# EAGLE design hwc (EAGLE 7.4.0)
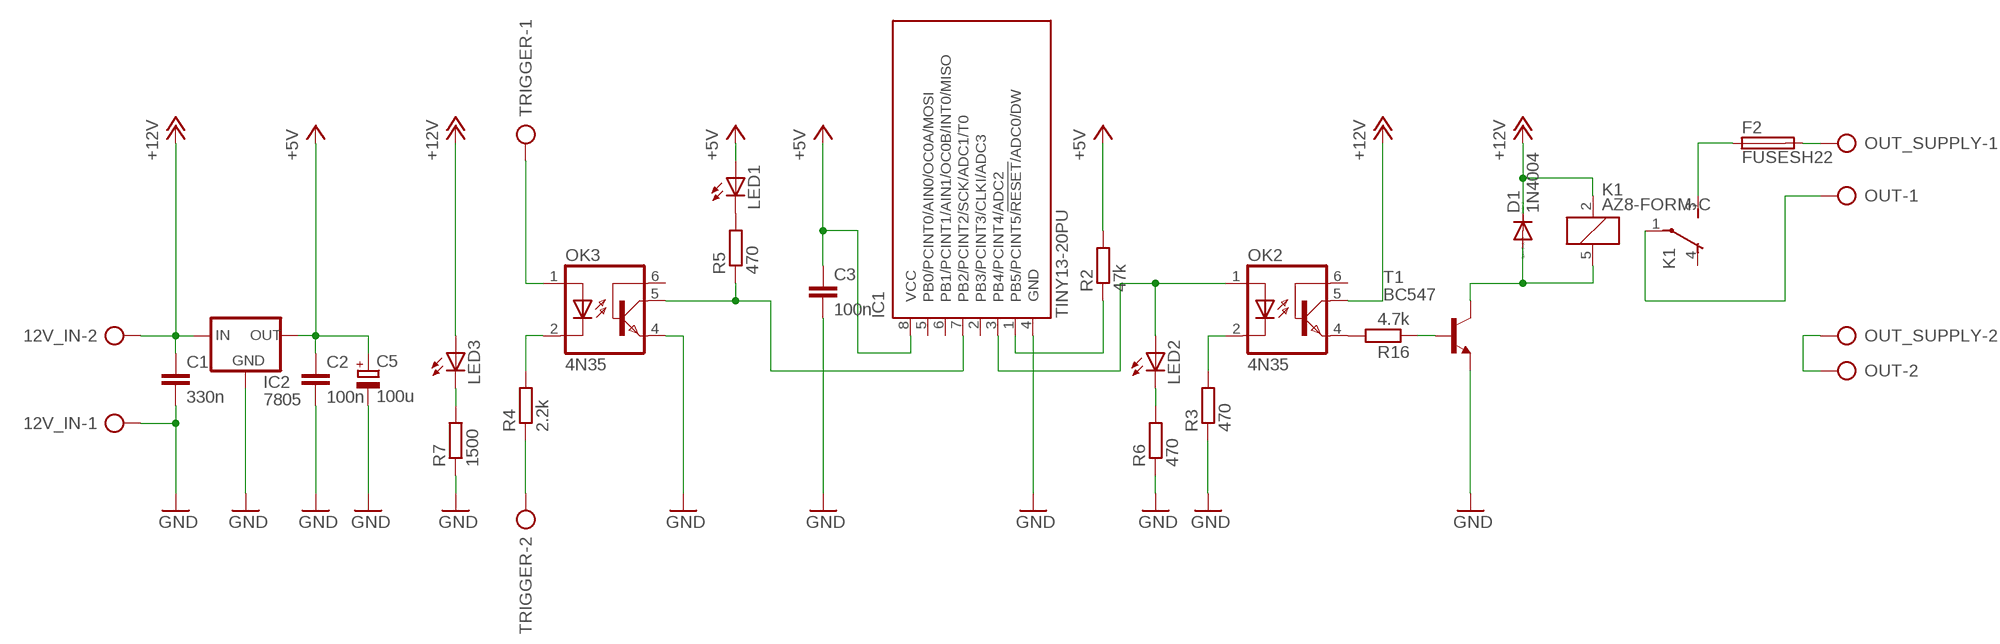
[diagram p0: schematic, sheet 1]

## Parts
12V_IN  AK300/2  [AK300/2]
C1  330n  C-EU050-025X075  [C050-025X075]
C2  100n  C-EU050-025X075  [C050-025X075]
C3  100n  C-EU050-025X075  [C050-025X075]
C5  100u  CPOL-EUE5-8.5  [E5-8,5]
D1  1N4004  [DO41-10]
F2  FUSESH22  [SH22]
IC1  TINY13-20PU  [DIL08]
IC2  7805  78XXL  [78XXL]
K1  AZ8-FORM-C  [AZ8]
LED1  LED5MM  [LED5MM]
LED2  LED5MM  [LED5MM]
LED3  LED5MM  [LED5MM]
OK2  4N35  [DIL06]
OK3  4N35  [DIL06]
OUT  AK300/2  [AK300/2]
OUT_SUPPLY  AK300/2  [AK300/2]
R2  47k  R-EU_0204/7  [0204/7]
R3  470  R-EU_0204/7  [0204/7]
R4  2.2k  R-EU_0204/7  [0204/7]
R5  470  R-EU_0204/7  [0204/7]
R6  470  R-EU_0204/7  [0204/7]
R7  1500  R-EU_0204/7  [0204/7]
R16  4.7k  R-EU_0204/7  [0204/7]
T1  BC547  [TO92]
TRIGGER  AK300/2  [AK300/2]

## Nets
+5V: C2.1 C3.1 C5.+ IC1.8(VCC) IC2.OUT LED1.A R2.2
+12V: 12V_IN.2 C1.1 D1.C IC2.IN K1.2 LED3.A OK2.5(COL)
GND: 12V_IN.1 C1.2 C2.2 C3.2 C5.- IC1.4(GND) IC2.GND OK3.4(EMI) R3.1 R6.1 R7.1 T1.1(E)
N$1: IC1.1(PB5/PCINT5/!RESET!/ADC0/DW) R2.1
N$2: LED1.K(C) R5.2
N$3: OUT.2 OUT_SUPPLY.2
N$4: F2.1 K1.3(-1:S)
N$5: K1.1(-1:P) OUT.1
N$6: LED2.K(C) R6.2
N$7: LED3.K(C) R7.2
N$8: OK2.2(C) R3.2
N$9: IC1.3(PB4/PCINT4/ADC2) LED2.A OK2.1(A)
N$10: F2.2 OUT_SUPPLY.1
N$11: OK3.2(C) R4.2
N$12: OK3.1(A) TRIGGER.1
N$13: R4.1 TRIGGER.2
N$14: IC1.7(PB2/PCINT2/SCK/ADC1/T0) OK3.5(COL) R5.1
N$35: OK2.4(EMI) R16.2
N$36: D1.A K1.5 T1.3(C)
N$37: R16.1 T1.2(B)
Unconnected: IC1.2(PB3/PCINT3/CLKI/ADC3) IC1.5(PB0/PCINT0/AIN0/OC0A/MOSI) IC1.6(PB1/PCINT1/AIN1/OC0B/INT0/MISO) K1.4(-1:O) OK2.6(BAS) OK3.6(BAS)

## Library data of the parts
12V_IN OUT OUT_SUPPLY TRIGGER = con-ptr500:AK300/2: CONNECTOR; OC_FARNELL: unknown; OC_NEWARK: unknown
C1-C3 = rcl:C-EU: CAPACITOR, European symbol
C5 = rcl:CPOL-EU: POLARIZED CAPACITOR, European symbol
D1 = diode:1N4004: DIODE general purpose rectifier, 1 A
F2 = fuse:FUSE: Fuse; OC_FARNELL: unknown; OC_NEWARK: unknown
IC1 = atmel:TINY13: 8-bit AVR Microcontroller with 1K Bytes In-System Programmable Flash Source: http://www.atmel.com/dyn/resources/prod_documents/2535S.pdf; MPN: ATTINY13-20PU; OC_FARNELL: 9171550; OC_NEWARK: 96K6521
IC2 = v-reg:78XXL: VOLTAGE REGULATOR
K1 = relay:AZ8-FORM-C: MINIATURE PC BOARD RELAY Form C Source: www.azettler.com .. AZ8-1ch-12DSE.PDF; OC_FARNELL: unknown; OC_NEWARK: unknown
LED1-LED3 = led:LED: LED OSRAM: - CHIPLED LG R971, LG N971, LY N971, LG Q971, LY Q971, LO R971, LY R971 LH N974, LH R974 LS Q976, LO Q976, LY Q976 LO Q996 - Hyper CHIPLED LW Q18S LB Q993, LB Q99A, LB R99A - SideLED LS A670, LO A670, LY A670, LG A670, LP A670 LB A673, LV A673, LT A673, LW A673 LH A674 LY A675 LS A676, LA A676, LO A676, LY A676, LW A676 LS A679, LY A679, LG A679 - Hyper Micro SIDELED® LS Y876, LA Y876, LO Y876, LY Y876 LT Y87S - SmartLED LW L88C, LW L88S LB L89C, LB L89S, LG L890 LS L89K, LO L89K, LY L89K LS L896, LA L896, LO L896, LY L896 - TOPLED LS T670, LO T670, LY T670, LG T670, LP T670 LSG T670, LSP T670, LSY T670, LOP T670, LYG T670 LG T671, LOG T671, LSG T671 LB T673, LV T673, LT T673, LW T673 LH T674 LS T676, LA T676, LO T676, LY T676, LB T676, LH T676, LSB T676, LW T676 LB T67C, LV T67C, LT T67C, LS T67K, LO T67K, LY T67K, LW E67C LS E67B, LA E67B, LO E67B, LY E67B, LB E67C, LV E67C, LT E67C LW T67C LS T679, LY T679, LG T679 LS T770, LO T770, LY T770, LG T770, LP T770 LB T773, LV T773, LT T773, LW T773 LH T774 LS E675, LA E675, LY E675, LS T675 LS T776, LA T776, LO T776, LY T776, LB T776 LHGB T686 LT T68C, LB T68C - Hyper Mini TOPLED® LB M676 - Mini TOPLED Santana® LG M470 LS M47K, LO M47K, LY M47K Source: http://www.osram.convergy.de LUXEON: - LUMILED® LXK2-PW12-R00, LXK2-PW12-S00, LXK2-PW14-U00, LXK2-PW14-V00 LXK2-PM12-R00, LXK2-PM12-S00, LXK2-PM14-U00 LXK2-PE12-Q00, LXK2-PE12-R00, LXK2-PE12-S00, LXK2-PE14-T00, LXK2-PE14-U00 LXK2-PB12-K00, LXK2-PB12-L00, LXK2-PB12-M00, LXK2-PB14-N00, LXK2-PB14-P00, LXK2-PB14-Q00 LXK2-PR12-L00, LXK2-PR12-M00, LXK2-PR14-Q00, LXK2-PR14-R00 LXK2-PD12-Q00, LXK2-PD12-R00, LXK2-PD12-S00 LXK2-PH12-R00, LXK2-PH12-S00 LXK2-PL12-P00, LXK2-PL12-Q00, LXK2-PL12-R00 Source: www.luxeon.com KINGBRIGHT: KA-3528ASYC Source: www.kingbright.com
OK2 OK3 = optocoupler:4N35: MOTOROLA OPTO COUPLER; MF: FAIRCHILD SEMICONDUCTOR; MPN: 4N35; OC_FARNELL: 1328375; OC_NEWARK: 72K9946
R2-R7 R16 = rcl:R-EU_: RESISTOR, European symbol
T1 = transistor:BC547: NPN TRANSISTOR

## Board
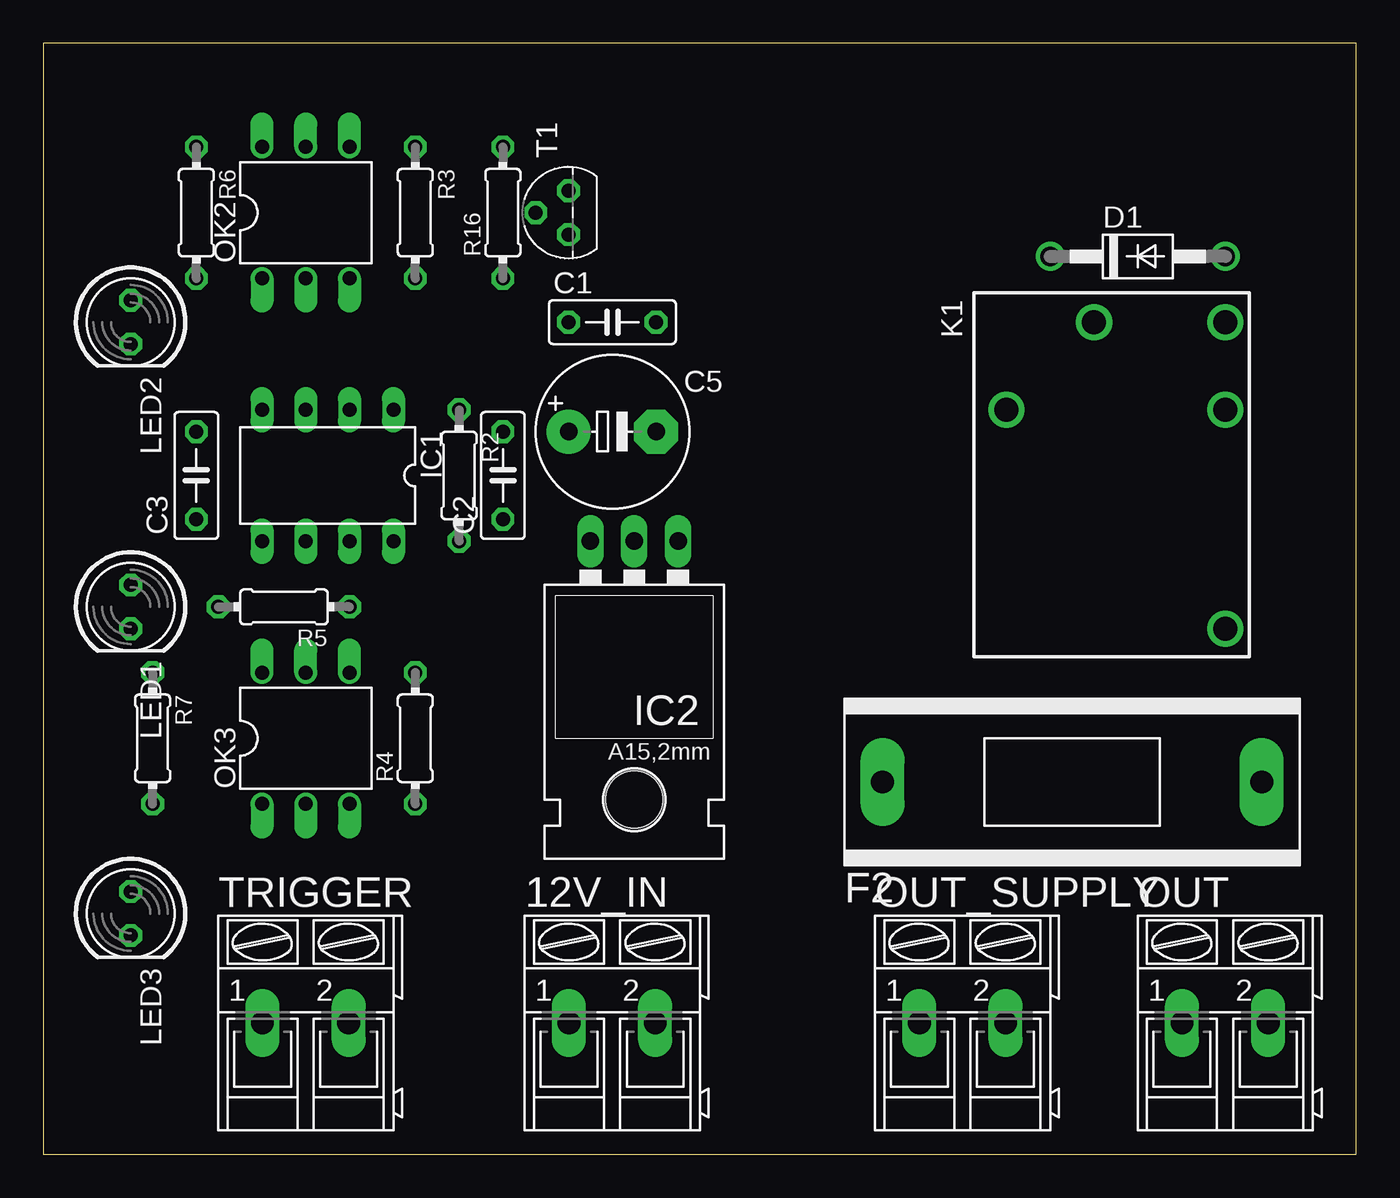
[diagram p1: board, top side]
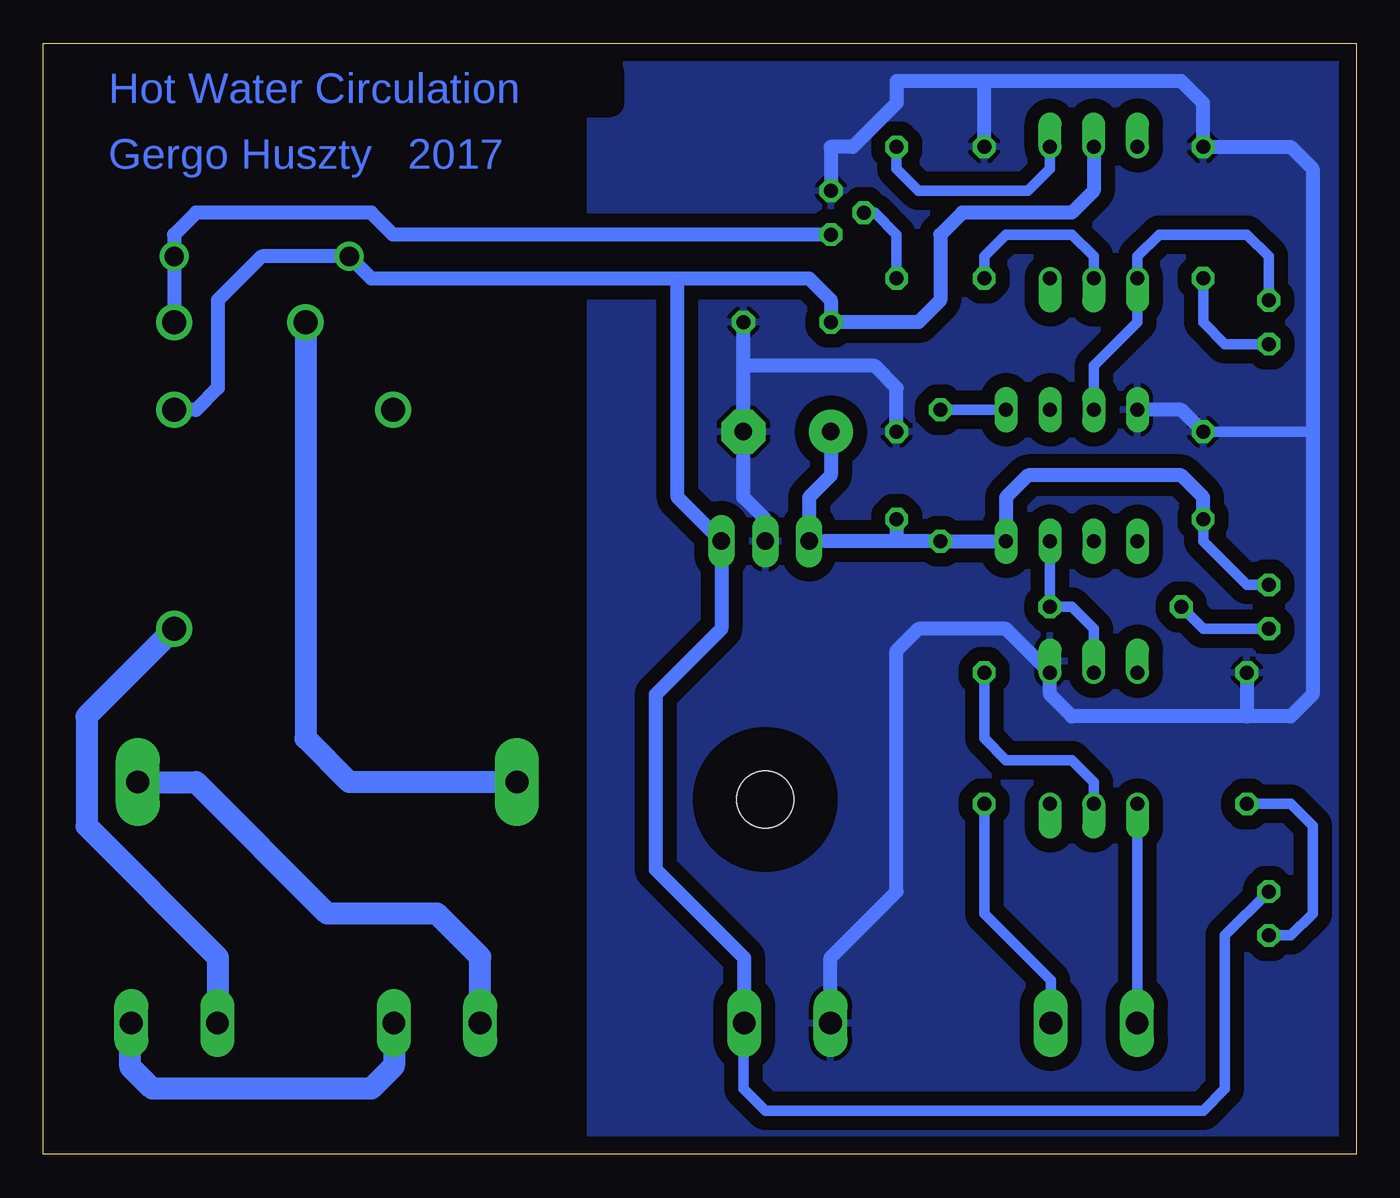
[diagram p2: board, bottom side, seen from below]

Size 76.18 x 64.44 mm. Coordinates in mm from the lower left corner, seen from the top.
Outline: 0,0 76.18,0 76.18,64.44 0,64.44 0,0
Copper layers (1*16): Top 0.035mm / dielectric 1.5mm / Bottom 0.035mm
Design rules "default *": minimum track width 10mil, minimum drill 24mil, track to track 32mil, track to pad 32mil, pad to pad 32mil, via to via 8mil, smd to smd 8mil, copper to edge 40mil, drill to drill 8mil, minimum pad ring 10mil, minimum via ring 8mil, stop-mask expansion 4mil, vias tented up to drill 0mil, thermal gap 10mil

### Footprints (pad centres in the part's own frame; a part is rotated, then mirrored left to right if it is on the bottom)
AK300/2 = drill 1.321 long: 1 -2.515,0; 2 2.489,0
C050-025X075 = drill 0.813 octagon: 1 -2.54,0; 2 2.54,0
E5-8,5 = drill 1.016 pad 2.54: + -2.54,0 | drill 1.016 pad 2.54 octagon: - 2.54,0
DO41-10 = drill 1.118: A 5.08,0; C -5.08,0
SH22 = drill 1.321 pad 2.54 long: 1 -10.998,0; 2 10.998,0
DIL08 = drill 0.813 long: 1 -3.81,-3.81; 2 -1.27,-3.81; 3 1.27,-3.81; 4 3.81,-3.81; 5 3.81,3.81; 6 1.27,3.81; 7 -1.27,3.81; 8 -3.81,3.81
78XXL = drill 1.016 long: GND 0,-3.81; IN -2.54,-3.81; OUT 2.54,-3.81 | hole 3.302: 0,11.176
AZ8 = drill 1.4 pad 2: 1 8.89,6.35; 2 -3.81,6.35; 3 -8.89,-1.27; 4 -3.81,-6.35; 5 -8.89,6.35
LED5MM = drill 0.813 octagon: A -1.27,0; K 1.27,0
DIL06 = drill 0.813 offset: 1 -2.54,-3.81; 2 0,-3.81; 3 2.54,-3.81; 4 2.54,3.81; 5 0,3.81; 6 -2.54,3.81
0204/7 = drill 0.813 octagon: 1 -3.81,0; 2 3.81,0
TO92 = drill 0.813 octagon: 1 1.27,0; 2 0,1.905; 3 -1.27,0

### Placement (x,y rotation side)
12V_IN  33.02,7.62 0 top
C1  33.02,48.26 0 top
C2  26.67,39.37 90 top
C3  8.89,39.37 90 top
C5  33.02,41.91 0 top
D1  63.5,52.07 0 top
F2  59.69,21.59 0 top
IC1  16.51,39.37 180 top
IC2  34.29,31.75 180 top
K1  62.23,39.37 270 top
LED1  5.08,31.75 270 top
LED2  5.08,48.26 270 top
LED3  5.08,13.97 270 top
OK2  15.24,54.61 0 top
OK3  15.24,24.13 0 top
OUT  68.58,7.62 0 top
OUT_SUPPLY  53.34,7.62 0 top
R2  24.13,39.37 270 top
R3  21.59,54.61 270 top
R4  21.59,24.13 90 top
R5  13.97,31.75 180 top
R6  8.89,54.61 270 top
R7  6.35,24.13 270 top
R16  26.67,54.61 90 top
T1  30.48,54.61 90 top
TRIGGER  15.24,7.62 0 top

### Tracks (layer width: path | path; a pad name or v marks a point on that pad's centre or on a via)
+5V
  Bottom 0.61: LED1.A 6.35,33.02 8.89,35.56 C3.1
  Bottom 0.813: C3.1 8.89,38.1 10.16,39.37 19.05,39.37 20.32,38.1 IC1.8 R2.2 26.67,35.56 | 26.67,35.56 IC2.OUT 31.75,38.1 30.48,39.37 C5.+ | C2.1 26.67,35.56
+12V
  Bottom 0.61: 12V_IN.2 35.56,7.57 35.56,3.81 34.29,2.54 8.89,2.54 7.62,3.81 7.62,12.7 LED3.A
  Bottom 0.813: OK2.5 15.24,55.88 16.51,54.61 22.86,54.61 24.13,53.34 24.13,49.53 25.4,48.26 C1.1 30.48,49.53 31.75,50.8 39.37,50.8 | 39.37,50.8 39.37,38.1 IC2.IN 36.83,30.48 40.64,26.67 40.64,16.51 35.51,11.38 12V_IN.2 | 39.37,50.8 57.15,50.8 D1.C 63.5,52.07 66.04,49.53 66.04,44.45 67.31,43.18 K1.2
GND
  Bottom 0.61: C3.2 2.54,41.91
  Bottom 0.813: 21.59,62.23 10.16,62.23 8.89,60.96 R6.1 3.81,58.42 2.54,57.15 2.54,41.91 2.54,26.67 3.81,25.4 6.35,25.4 | 21.59,62.23 26.67,62.23 26.67,60.96 29.21,58.42 30.48,58.42 T1.1 | R3.1 21.59,62.23 | C3.2 10.16,43.18 IC1.4 | 6.35,25.4 16.51,25.4 17.78,26.67 OK3.4 20.32,30.48 25.4,30.48 26.67,29.21 26.67,15.24 30.5,11.4 12V_IN.1 | R7.1 6.35,25.4 | 35.56,45.72 C5.- 35.56,38.1 34.29,36.83 IC2.GND | 35.56,45.72 C1.2 | C2.2 26.67,44.45 27.94,45.72 35.56,45.72
  pour Bottom: 0,64.77 44.45,64.77 44.45,0 0,0
N$1
  Bottom 0.61: IC1.1 R2.1
N$2
  Bottom 0.61: LED1.K 8.89,30.48 R5.2
N$3
  Bottom 1.27: OUT_SUPPLY.2 55.83,5.13 57.15,3.81 69.85,3.81 71.12,5.08 71.12,7.57 OUT.2
N$4
  Bottom 1.27: K1.3 60.96,24.13 58.42,21.59 F2.1
N$5
  Bottom 1.27: K1.1 73.66,25.4 73.66,19.05 66.04,11.43 66.04,7.64 OUT.1
N$6
  Bottom 0.61: LED2.K 7.62,46.99 8.89,48.26 R6.2
N$7
  Bottom 0.61: R7.2 3.81,20.32 2.54,19.05 2.54,13.97 3.81,12.7 LED3.K
N$8
  Bottom 0.61: OK2.2 15.24,52.07 16.51,53.34 20.32,53.34 21.59,52.07 R3.2
N$9
  Bottom 0.61: IC1.3 15.24,45.72 12.7,48.26 OK2.1 12.7,52.07 11.43,53.34 6.35,53.34 5.08,52.07 LED2.A
N$10
  Bottom 1.27: OUT_SUPPLY.1 50.83,11.46 53.34,13.97 59.69,13.97 67.31,21.59 F2.2
N$11
  Bottom 0.61: OK3.2 15.24,21.59 16.51,22.86 20.32,22.86 21.59,24.13 R4.2
N$12
  Bottom 0.61: OK3.1 12.7,7.64 TRIGGER.1
N$13
  Bottom 0.61: TRIGGER.2 17.73,10.11 21.59,13.97 R4.1
N$14
  Bottom 0.61: IC1.7 R5.1 16.51,31.75 15.24,30.48 OK3.5
N$35
  Bottom 0.61: OK2.4 17.78,57.15 19.05,55.88 25.4,55.88 26.67,57.15 R16.2
N$36
  Bottom 0.813: T1.3 55.88,53.34 57.15,54.61 67.31,54.61 68.58,53.34 D1.A K1.5
N$37
  Bottom 0.61: R16.1 26.67,53.34 27.94,54.61 T1.2

### Text on the board
Bottom: Hot Water Circulation | Gergo Huszty 2017